# Altium schematic sheet Directional_Coupler.SchDoc
size A4; SheetNumber: 1; SheetTotal: 1
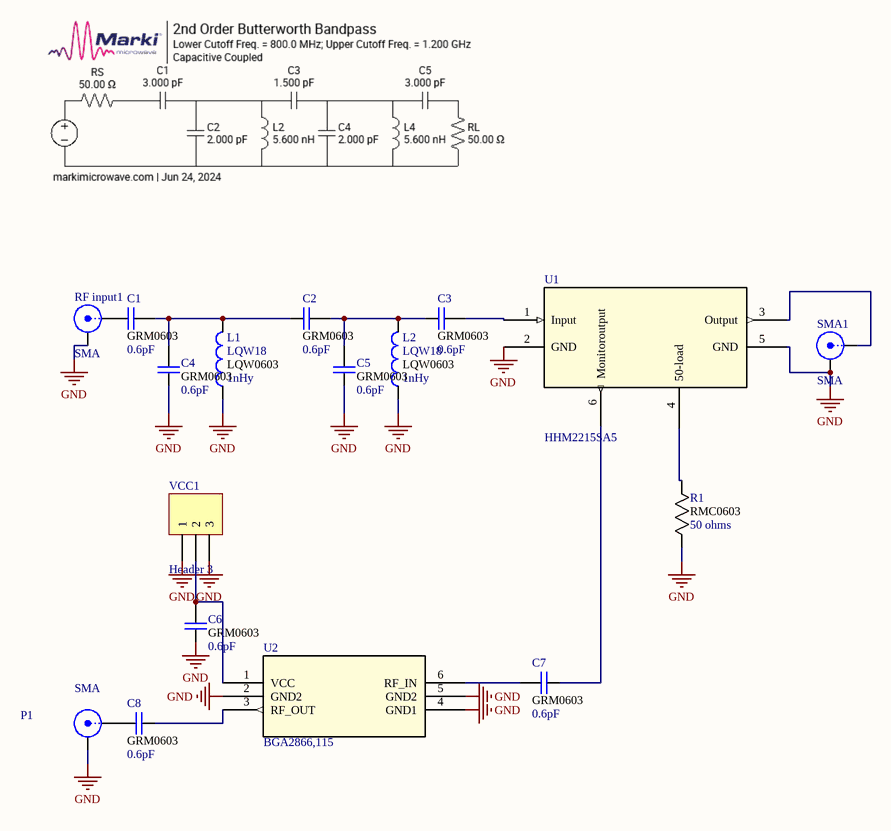
[diagram p0: Directional_Coupler.SchDoc]

## Parts
C1  value 0.6pF  footprint: GRM0603  [CAPC1608X90N]  (hidden comment: Cap 0603)
C2  value 0.6pF  footprint: GRM0603  [CAPC1608X90N]  (hidden comment: Cap 0603)
C3  value 0.6pF  footprint: GRM0603  [CAPC1608X90N]  (hidden comment: Cap 0603)
C4  value 0.6pF  footprint: GRM0603  [CAPC1608X90N]  (hidden comment: Cap 0603)
C5  value 0.6pF  footprint: GRM0603  [CAPC1608X90N]  (hidden comment: Cap 0603)
C6  value 0.6pF  footprint: GRM0603  [CAPC1608X90N]  (hidden comment: Cap 0603)
C7  value 0.6pF  footprint: GRM0603  [CAPC1608X90N]  (hidden comment: Cap 0603)
C8  value 0.6pF  footprint: GRM0603  [CAPC1608X90N]  (hidden comment: Cap 0603)
L1  LQW18  value 1nHy  Parameter 1: LQW0603  [INDC1608X100N]
L2  LQW18  value 1nHy  Parameter 1: LQW0603  [INDC1608X100N]
P1  SMA  [SMA-142-0701-851_V2]
R1  value 50 ohms  footprint: RMC0603  [RESC1508X55N]  (hidden comment: Resistor)
RF_input1  SMA  [SMA-142-0701-851_V2]
SMA1  SMA  [SMA-142-0701-851_V2]
U1  HHM2215SA5  [HHM-6_1P6X0P8]
U2  BGA2866,115  [SOT363_NXP]
VCC1  Header 3  [HDR1X3]

## Nets
GND: C4.1 C5.1 C6.1 L1.1 L2.1 P1.2(Y) R1.1 RF_input1.2(Y) SMA1.2(Y) U1.2(GND) U1.5(GND) U2.2(GND2) U2.4(GND1) U2.5(GND2) VCC1.1 VCC1.3
NetC1_1: C1.1 RF_input1.1(X)
NetC1_2: C1.2 C2.1 C4.2 L1.2
NetC2_2: C2.2 C3.1 C5.2 L2.2
NetC3_2: C3.2 U1.1(Input)
NetC6_2: C6.2 U2.1(VCC) VCC1.2
NetC7_1: C7.1 U1.6(Monitoroutput)
NetC7_2: C7.2 U2.6(RF_IN)
NetC8_1: C8.1 U2.3(RF_OUT)
NetC8_2: C8.2 P1.1(X)
NetR1_2: R1.2 U1.4(50-load)
NetSMA1_1: SMA1.1(X) U1.3(Output)

## Library data of the parts
C1-C8 = Cap: Capacitor GRM18 0603; Published: 8-Jun-2000; LatestRevisionDate: 17-Jul-2002; LatestRevisionNote: Re-released for DXP Platform.; PackageReference: POLAR0.8; Publisher: Altium Limited; PackageDescription: Polarized Capacitor; 2 Leads; Supplier 1: Mouser
L1 L2 = LQW18: Ind RF Chip Wirewound 18nH 5% 100MHz 40Q-Factor 550mA 0603 Paper T/R; MP: LQW18AN18NJ00D; Package: None; Price: None; Availability: Unavailable
P1 = SMB: SMB Straight Connector; LatestRevisionDate: 17-Jul-2002; LatestRevisionNote: Re-released for DXP Platform.; Publisher: Altium Limited
R1 = Resistor: Resistor RMC0603; Mfr_Name: Stackpole International
RF_input1 SMA1 = SMA: SMA Straight Connector; LatestRevisionDate: 17-Jul-2002; LatestRevisionNote: Re-released for DXP Platform.; Publisher: Altium Limited
U1 = HHM2215SA5: No Description Available; Mfr_Name: TDK; RefDes: RefDes; Type: Type
U2 = BGA2866,115: No Description Available; Mfr_Name: NXP; RefDes: RefDes; Type: Type
VCC1 = Header 3: Header, 3-Pin; LatestRevisionDate: 17-Jul-2002; LatestRevisionNote: Re-released for DXP Platform.; Publisher: Altium Limited